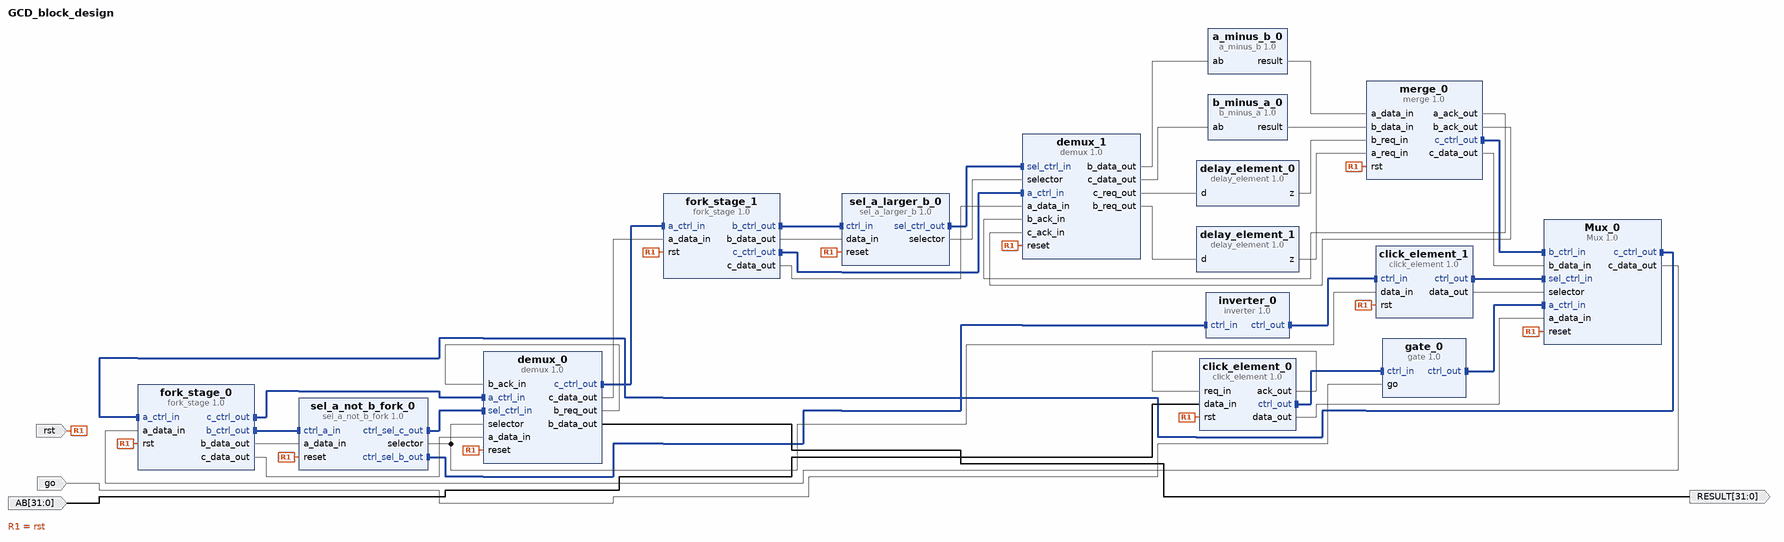
[diagram p0: block diagram of the top level]
# Vivado block design GCD_block_design, xc7k70tfbv676-1, Vivado 2017.4
create_bd_design GCD_block_design

create_bd_port -dir I rst
create_bd_port -dir I go
create_bd_port -dir O -from 31 -to 0 RESULT
create_bd_port -dir I -from 31 -to 0 AB

create_bd_cell -type ip -vlnv xilinx.com:click_components:click_element:1.0 click_element_0
set_property -dict {CONFIG.VALUE 80872186 CONFIG.PHASE_INIT {"1"}} [get_bd_cells click_element_0]
create_bd_cell -type ip -vlnv xilinx.com:click_components:click_element:1.0 click_element_1
set_property -dict {CONFIG.DATA_WIDTH_1 1 CONFIG.VALUE 1 CONFIG.PHASE_INIT {"1"}} [get_bd_cells click_element_1]
create_bd_cell -type ip -vlnv xilinx.com:click_components:gate:1.0 gate_0
create_bd_cell -type ip -vlnv xilinx.com:click_components:inverter:1.0 inverter_0
create_bd_cell -type ip -vlnv xilinx.com:click_components:Mux:1.0 Mux_0
create_bd_cell -type ip -vlnv xilinx.com:click_components:demux:1.0 demux_0
create_bd_cell -type ip -vlnv xilinx.com:click_components:demux:1.0 demux_1
create_bd_cell -type ip -vlnv xilinx.com:click_components:fork_stage:1.0 fork_stage_0
create_bd_cell -type ip -vlnv xilinx.com:click_components:fork_stage:1.0 fork_stage_1
create_bd_cell -type ip -vlnv xilinx.com:click_components:sel_a_larger_b:1.0 sel_a_larger_b_0
create_bd_cell -type ip -vlnv xilinx.com:click_components:sel_a_not_b_fork:1.0 sel_a_not_b_fork_0
create_bd_cell -type ip -vlnv xilinx.com:click_components:merge:1.0 merge_0
create_bd_cell -type ip -vlnv xilinx.com:click_components:a_minus_b:1.0 a_minus_b_0
create_bd_cell -type ip -vlnv xilinx.com:click_components:b_minus_a:1.0 b_minus_a_0
create_bd_cell -type ip -vlnv xilinx.com:click_components:delay_element:1.0 delay_element_0
set_property -dict {CONFIG.size 15} [get_bd_cells delay_element_0]
create_bd_cell -type ip -vlnv xilinx.com:click_components:delay_element:1.0 delay_element_1
set_property -dict {CONFIG.size 15} [get_bd_cells delay_element_1]

# ---- connections ----

connect_bd_intf_net [get_bd_intf_pins click_element_0/ctrl_out] [get_bd_intf_pins gate_0/ctrl_in]
connect_bd_intf_net [get_bd_intf_pins gate_0/ctrl_out] [get_bd_intf_pins Mux_0/a_ctrl_in]
connect_bd_intf_net [get_bd_intf_pins Mux_0/sel_ctrl_in] [get_bd_intf_pins click_element_1/ctrl_out]
connect_bd_intf_net [get_bd_intf_pins inverter_0/ctrl_out] [get_bd_intf_pins click_element_1/ctrl_in]
connect_bd_intf_net [get_bd_intf_pins Mux_0/c_ctrl_out] [get_bd_intf_pins fork_stage_0/a_ctrl_in]
connect_bd_intf_net [get_bd_intf_pins fork_stage_0/b_ctrl_out] [get_bd_intf_pins sel_a_not_b_fork_0/ctrl_a_in]
connect_bd_intf_net [get_bd_intf_pins fork_stage_0/c_ctrl_out] [get_bd_intf_pins demux_0/a_ctrl_in]
connect_bd_intf_net [get_bd_intf_pins sel_a_not_b_fork_0/ctrl_sel_c_out] [get_bd_intf_pins demux_0/sel_ctrl_in]
connect_bd_intf_net [get_bd_intf_pins sel_a_not_b_fork_0/ctrl_sel_b_out] [get_bd_intf_pins inverter_0/ctrl_in]
connect_bd_intf_net [get_bd_intf_pins fork_stage_1/a_ctrl_in] [get_bd_intf_pins demux_0/c_ctrl_out]
connect_bd_intf_net [get_bd_intf_pins fork_stage_1/b_ctrl_out] [get_bd_intf_pins sel_a_larger_b_0/ctrl_in]
connect_bd_intf_net [get_bd_intf_pins sel_a_larger_b_0/sel_ctrl_out] [get_bd_intf_pins demux_1/sel_ctrl_in]
connect_bd_intf_net [get_bd_intf_pins fork_stage_1/c_ctrl_out] [get_bd_intf_pins demux_1/a_ctrl_in]
connect_bd_intf_net [get_bd_intf_pins merge_0/c_ctrl_out] [get_bd_intf_pins Mux_0/b_ctrl_in]
connect_bd_net [get_bd_pins click_element_1/data_out] [get_bd_pins Mux_0/selector]
connect_bd_net [get_bd_pins Mux_0/c_data_out] [get_bd_pins fork_stage_0/a_data_in]
connect_bd_net [get_bd_pins click_element_0/data_out] [get_bd_pins Mux_0/a_data_in]
connect_bd_net [get_bd_pins fork_stage_0/b_data_out] [get_bd_pins sel_a_not_b_fork_0/a_data_in]
connect_bd_net [get_bd_pins fork_stage_0/c_data_out] [get_bd_pins demux_0/a_data_in]
connect_bd_net [get_bd_pins sel_a_not_b_fork_0/selector] [get_bd_pins click_element_1/data_in] [get_bd_pins demux_0/selector]
connect_bd_net [get_bd_pins demux_0/c_data_out] [get_bd_pins fork_stage_1/a_data_in]
connect_bd_net [get_bd_pins fork_stage_1/b_data_out] [get_bd_pins sel_a_larger_b_0/data_in]
connect_bd_net [get_bd_pins sel_a_larger_b_0/selector] [get_bd_pins demux_1/selector]
connect_bd_net [get_bd_pins fork_stage_1/c_data_out] [get_bd_pins demux_1/a_data_in]
connect_bd_net [get_bd_pins demux_1/b_data_out] [get_bd_pins a_minus_b_0/ab]
connect_bd_net [get_bd_pins demux_1/c_data_out] [get_bd_pins b_minus_a_0/ab]
connect_bd_net [get_bd_pins a_minus_b_0/result] [get_bd_pins merge_0/a_data_in]
connect_bd_net [get_bd_pins b_minus_a_0/result] [get_bd_pins merge_0/b_data_in]
connect_bd_net [get_bd_pins merge_0/c_data_out] [get_bd_pins Mux_0/b_data_in]
connect_bd_net [get_bd_pins demux_1/b_req_out] [get_bd_pins delay_element_1/d]
connect_bd_net [get_bd_pins delay_element_1/z] [get_bd_pins merge_0/a_req_in]
connect_bd_net [get_bd_pins merge_0/a_ack_out] [get_bd_pins demux_1/b_ack_in]
connect_bd_net [get_bd_pins demux_1/c_req_out] [get_bd_pins delay_element_0/d]
connect_bd_net [get_bd_pins delay_element_0/z] [get_bd_pins merge_0/b_req_in]
connect_bd_net [get_bd_pins merge_0/b_ack_out] [get_bd_pins demux_1/c_ack_in]
connect_bd_net [get_bd_pins demux_0/b_req_out] [get_bd_pins demux_0/b_ack_in]
connect_bd_net [get_bd_ports rst] \
  [get_bd_pins click_element_0/rst] [get_bd_pins merge_0/rst] [get_bd_pins click_element_1/rst] [get_bd_pins Mux_0/reset] \
  [get_bd_pins fork_stage_0/rst] [get_bd_pins demux_1/reset] [get_bd_pins sel_a_larger_b_0/reset] \
  [get_bd_pins sel_a_not_b_fork_0/reset] [get_bd_pins demux_0/reset] [get_bd_pins fork_stage_1/rst]
connect_bd_net [get_bd_ports go] [get_bd_pins gate_0/go]
connect_bd_net [get_bd_pins click_element_0/ack_out] [get_bd_pins click_element_0/req_in]
connect_bd_net [get_bd_pins demux_0/b_data_out] [get_bd_ports RESULT]
connect_bd_net [get_bd_ports AB] [get_bd_pins click_element_0/data_in]

validate_bd_design
save_bd_design
